# EAGLE schematic schematic (EAGLE 9.5.2)
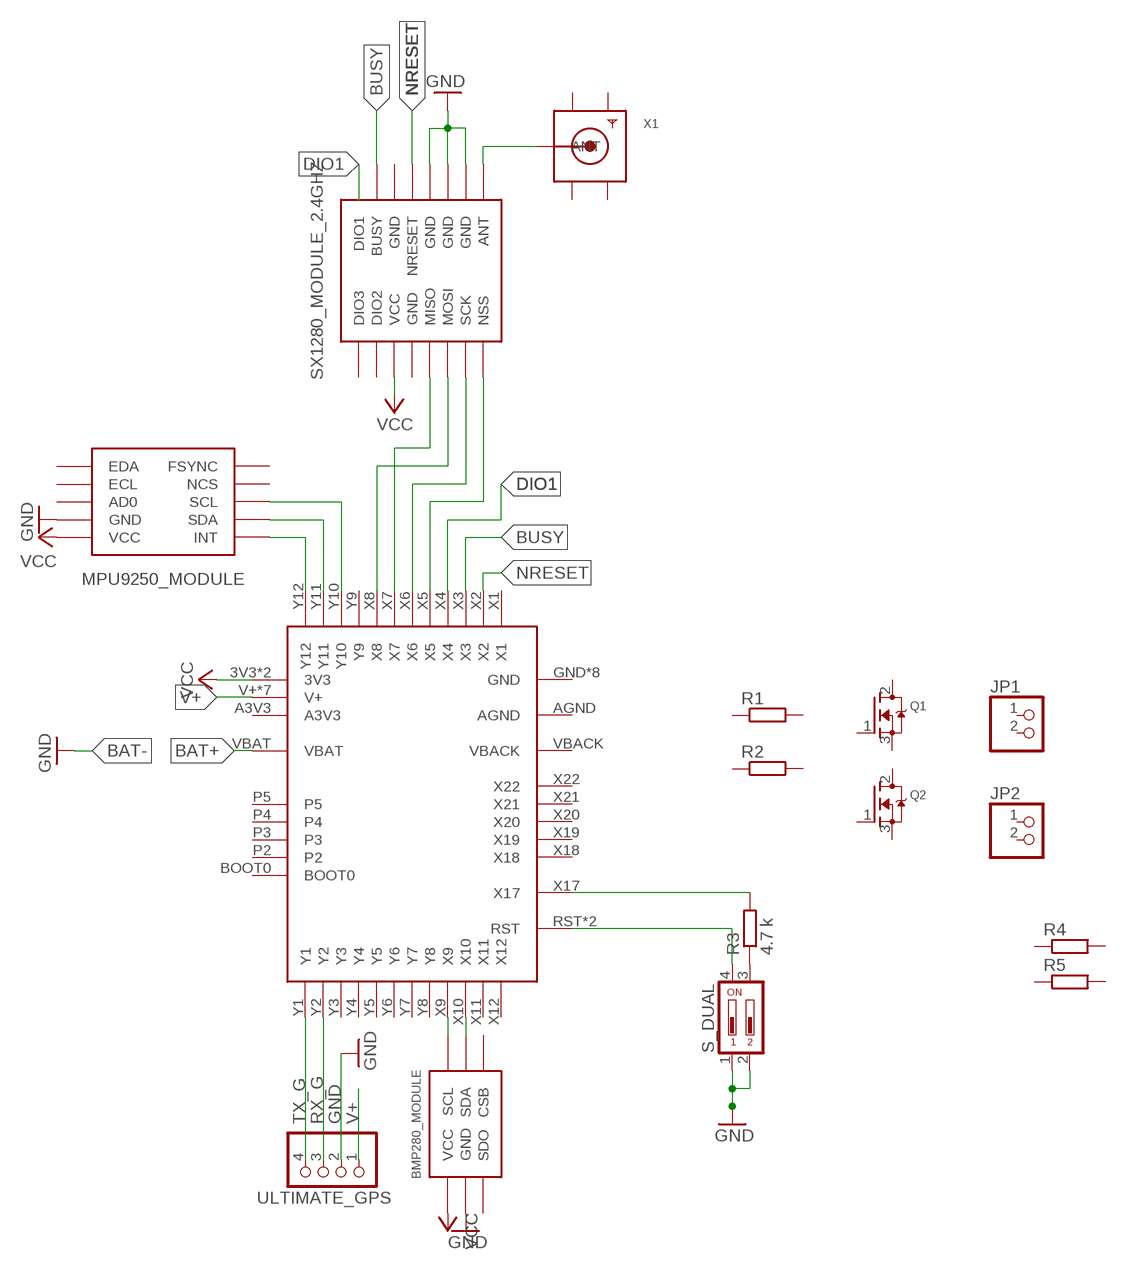
[diagram p0: schematic, sheet 1]

## Parts
JP1  PINHD-1X2  [1X02]
JP2  PINHD-1X2  [1X02]
Q1  MOSFET-NGDS_TO220V  [TO220V]
Q2  MOSFET-NGDS_TO220V  [TO220V]
R1  R-EU_0204/7  [0204/7]
R2  R-EU_0204/7  [0204/7]
R3  4.7 k  R-EU_0204/7  [0204/7]
R4  R-EU_0204/7  [0204/7]
R5  R-EU_0207/10  [0207/10]
U$1  PYBOARD1.1  [MODULE_PYBOARD]
U$3  MPU9250  [MODULE_MPU9250]
U$4  BMP280  [MODULE_BMP280]
U$5  SWITCH_DUAL  [SWITCH_DUAL]
U$6  SX1280_2.4GHZ  [MODULE_SX1280_THT]
ULTIMATE_GPS  PINHD-1X4  [1X04]
X1  SMACONNECTOR  [SMA_DIP]

## Nets
BAT+: U$1.VBAT
BUSY: U$1.X3 U$6.BUSY
DIO1: U$1.X4
GND: U$3.GND U$4.GND U$5.1 U$5.2 U$6.GND@3(GND) U$6.GND@4(GND) U$6.GND@5(GND) ULTIMATE_GPS.2
N$1: U$1.X5 U$6.NSS
N$2: U$1.X6 U$6.SCK
N$3: U$1.X8 U$6.MOSI
N$4: U$1.X7 U$6.MISO
N$5: U$6.ANT X1.ANTENNA(ANT)
N$6: U$6.DIO1
N$7: R3.1 U$5.3
N$8: U$1.Y11 U$3.SDA
N$9: U$1.Y10 U$3.SCL
N$10: U$1.Y12 U$3.INT
N$11: U$1.X9 U$4.SCL
N$12: U$1.X10 U$4.SDA
N$13: U$1.RST U$1.RST1(RST) U$5.4
N$14: R3.2 U$1.X17
NRESET: U$1.X2 U$6.NRESET
RX_G: U$1.Y2 ULTIMATE_GPS.3
TX_G: U$1.Y1 ULTIMATE_GPS.4
V+: U$1.V+ U$1.V+1(V+) U$1.V+2(V+) U$1.V+3(V+) U$1.V+4(V+) U$1.V+5(V+) U$1.V+6(V+) ULTIMATE_GPS.1
VCC: U$1.3V3 U$1.3V3-1(3V3) U$3.VCC U$4.VCC U$6.VCC
Unconnected: JP1.1 JP1.2 JP2.1 JP2.2 Q1.1(G) Q1.2(D) Q1.3(S) Q2.1(G) Q2.2(D) Q2.3(S) R1.1 R1.2 R2.1 R2.2 R4.1 R4.2 R5.1 R5.2 U$1.A3V3 U$1.AGND U$1.BOOT0 U$1.GND U$1.GND0(GND) U$1.GND1(GND) U$1.GND2(GND) U$1.GND3(GND) U$1.GND4(GND) U$1.GND5(GND) U$1.GND6(GND) U$1.P2 U$1.P3 U$1.P4 U$1.P5 U$1.VBACK U$1.X1 U$1.X11 U$1.X12 U$1.X18 U$1.X19 U$1.X20 U$1.X21 U$1.X22 U$1.Y3 U$1.Y4 U$1.Y5 U$1.Y6 U$1.Y7 U$1.Y8 U$1.Y9 U$3.AD0 U$3.ECL U$3.EDA U$3.FSYNC U$3.NCS U$4.CSB U$4.SDO U$6.DIO2 U$6.DIO3 U$6.GND@1(GND) U$6.GND@2(GND)

## Power pins joined to a net without a drawn wire
GND1: X1.GND1
GND2: X1.GND2
GND3: X1.GND3
GND4: X1.GND4

## Library data of the parts
JP1 JP2 = pinhead:PINHD-1X2: PIN HEADER
Q1 Q2 = adafruit:MOSFET-N: N-Channel Mosfet 2N7002E - 60V 260mA SOT23 [Digikey: 2N7002ET1GOSTR-ND] - REEL BSH103 - 30V 850mA SOT23 [Digikey: 568-5013-1-ND]
R1-R5 = rcl:R-EU_: RESISTOR, European symbol; SPICEPREFIX: R
U$1 = SobieskiSat2:PYBOARD1.1
U$3 = SobieskiSat2:MPU9250
U$4 = SobieskiSat2:BMP280
U$5 = SobieskiSat2:SWITCH_DUAL
U$6 = SobieskiSat2:SX1280_2.4GHZ
ULTIMATE_GPS = pinhead:PINHD-1X4: PIN HEADER
X1 = SobieskiSat2:SMACONNECTOR: SMA Connector 90° DIP SMA Connector, 50 Ohm (4UConnector: 07259)